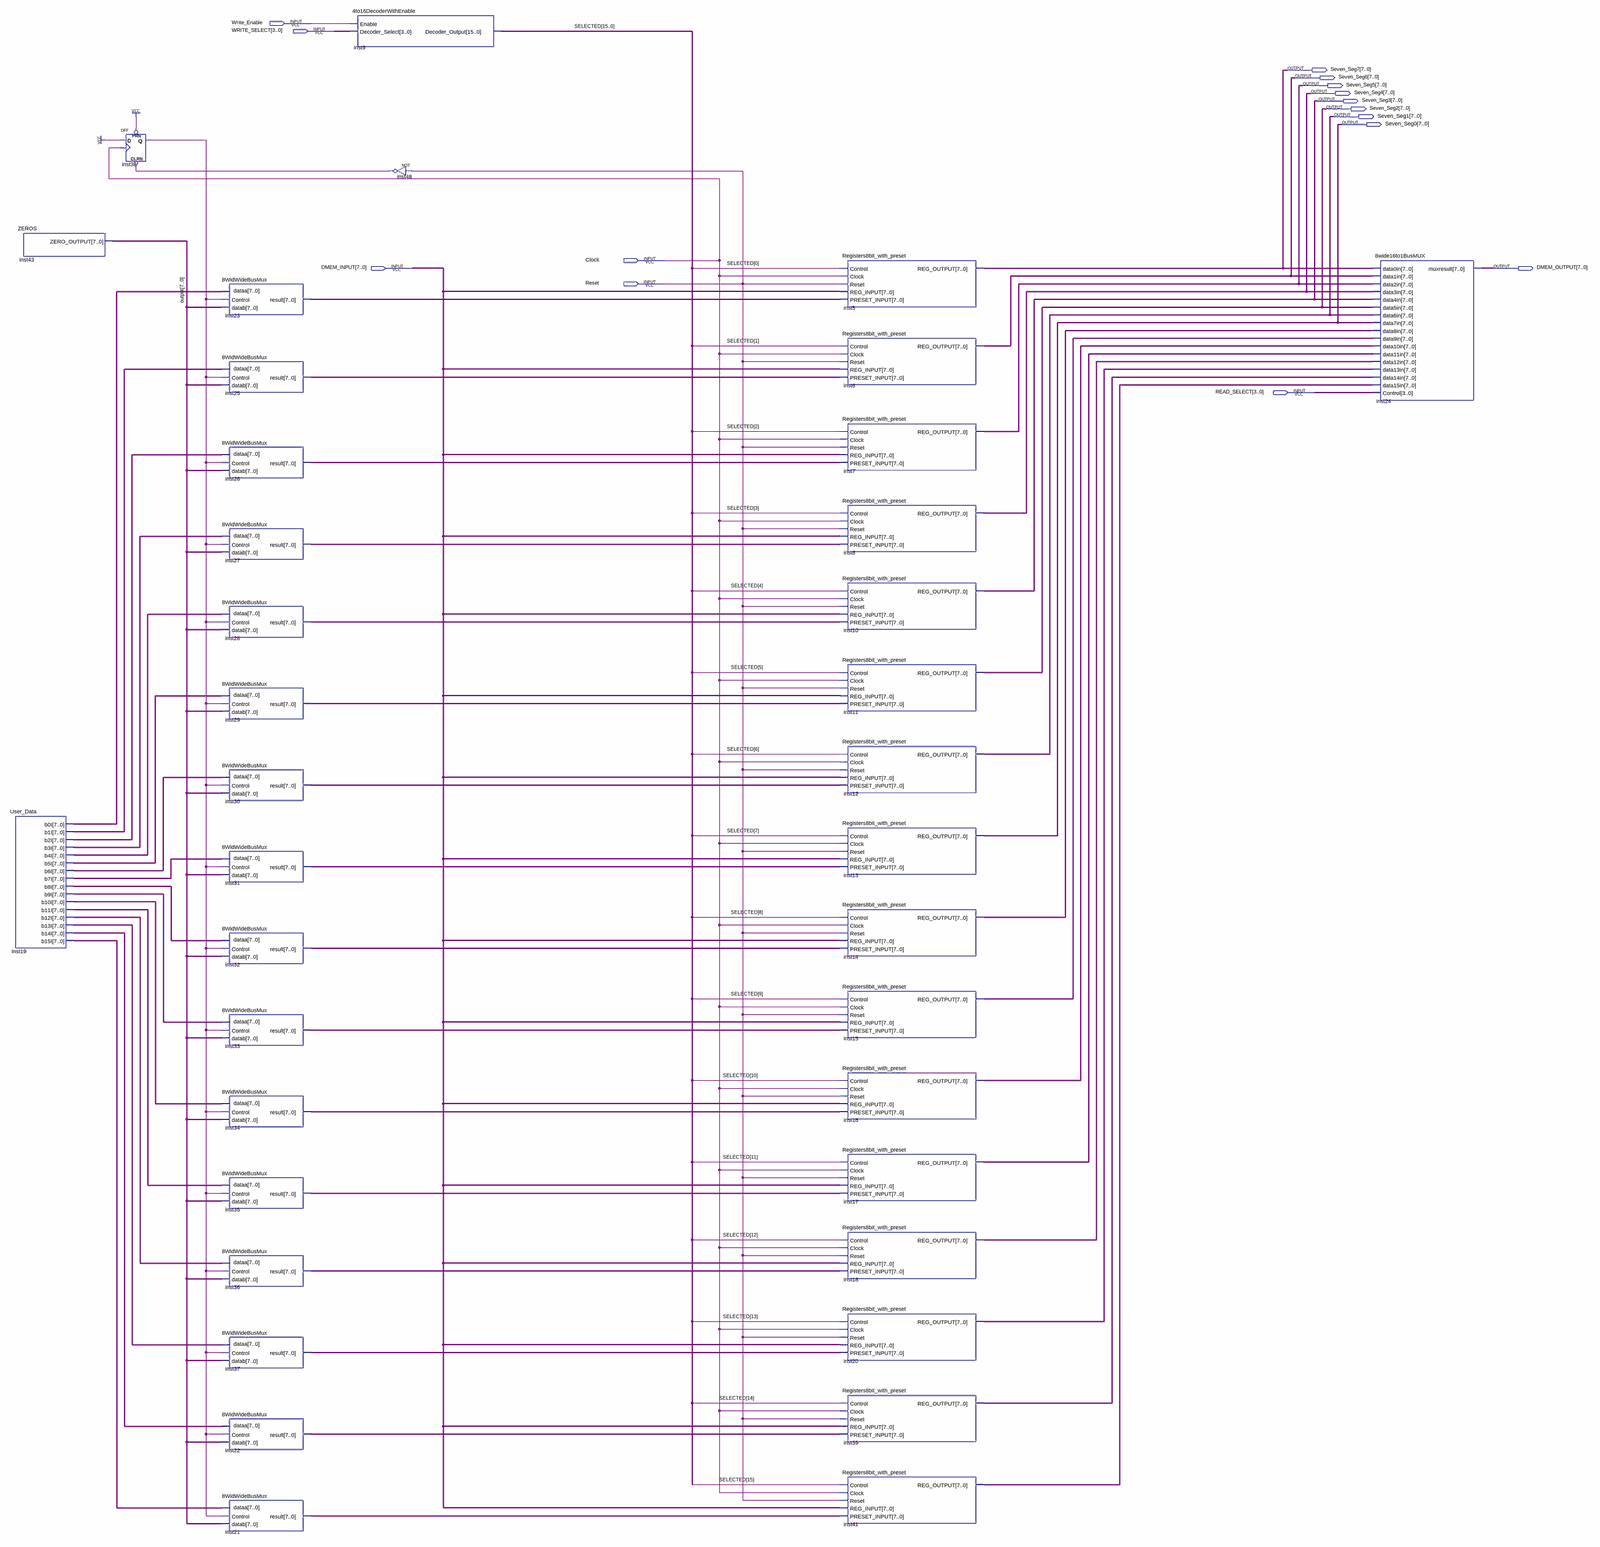
[diagram p0: schematic sheet, whole]
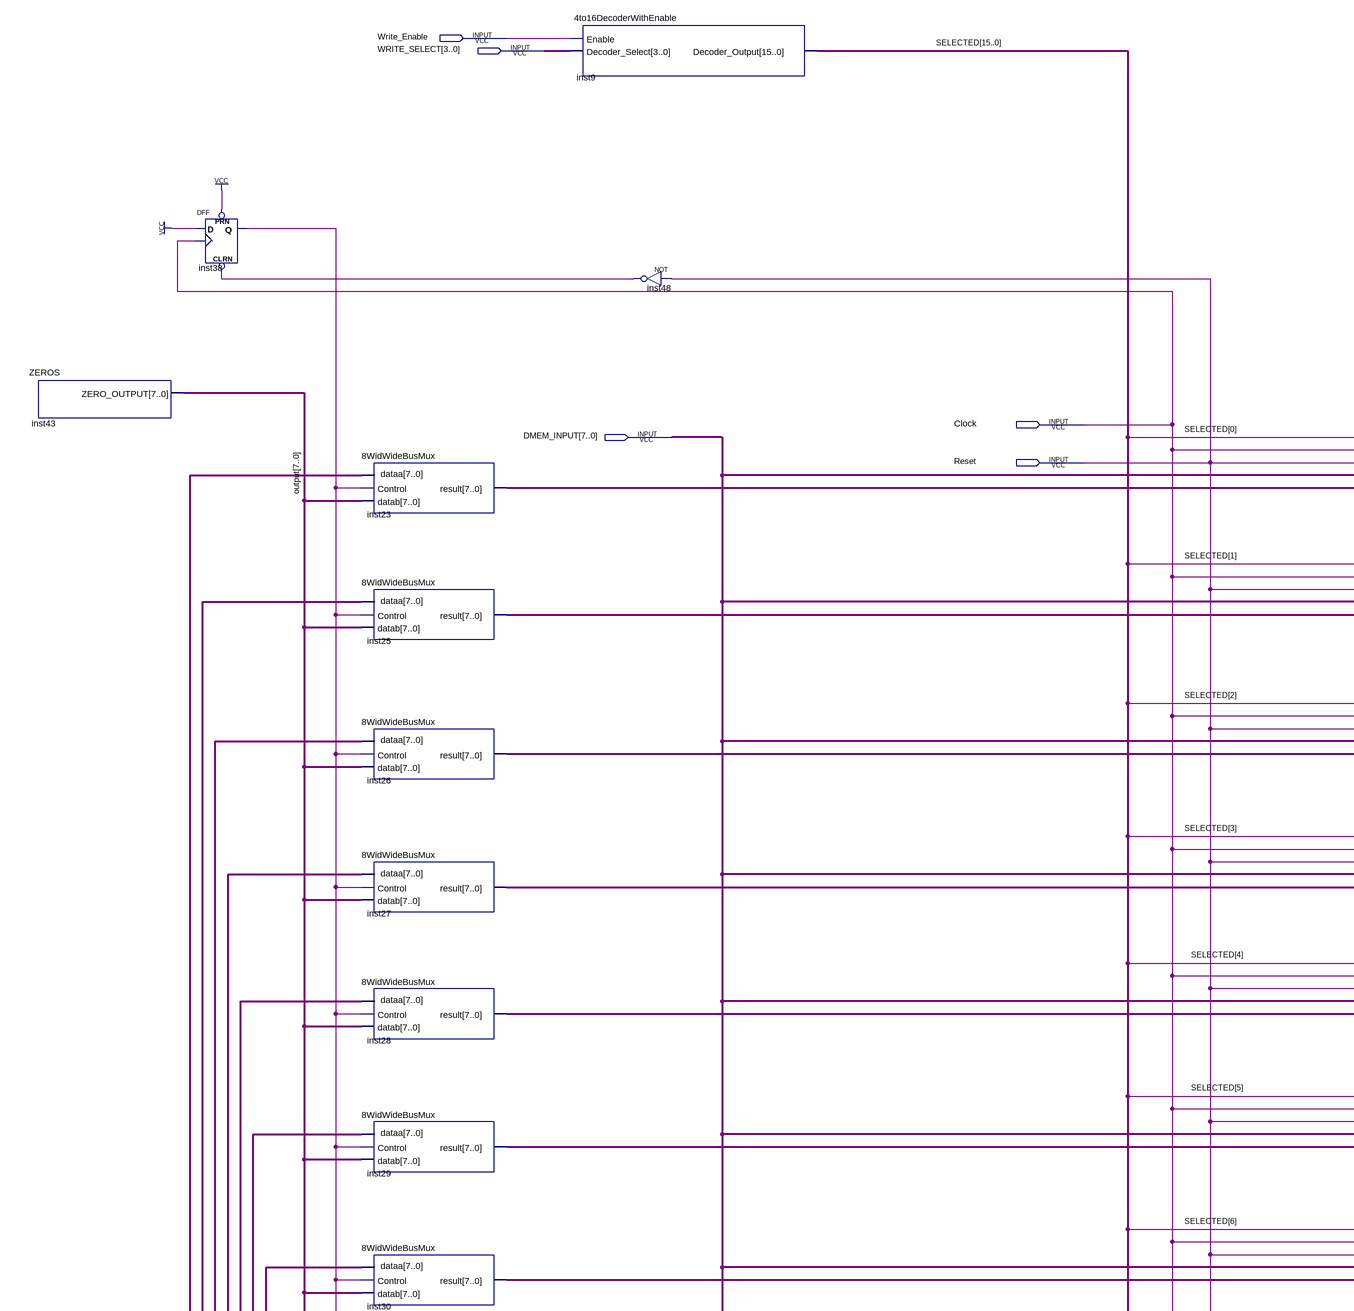
[diagram p1: schematic sheet, upper left part]
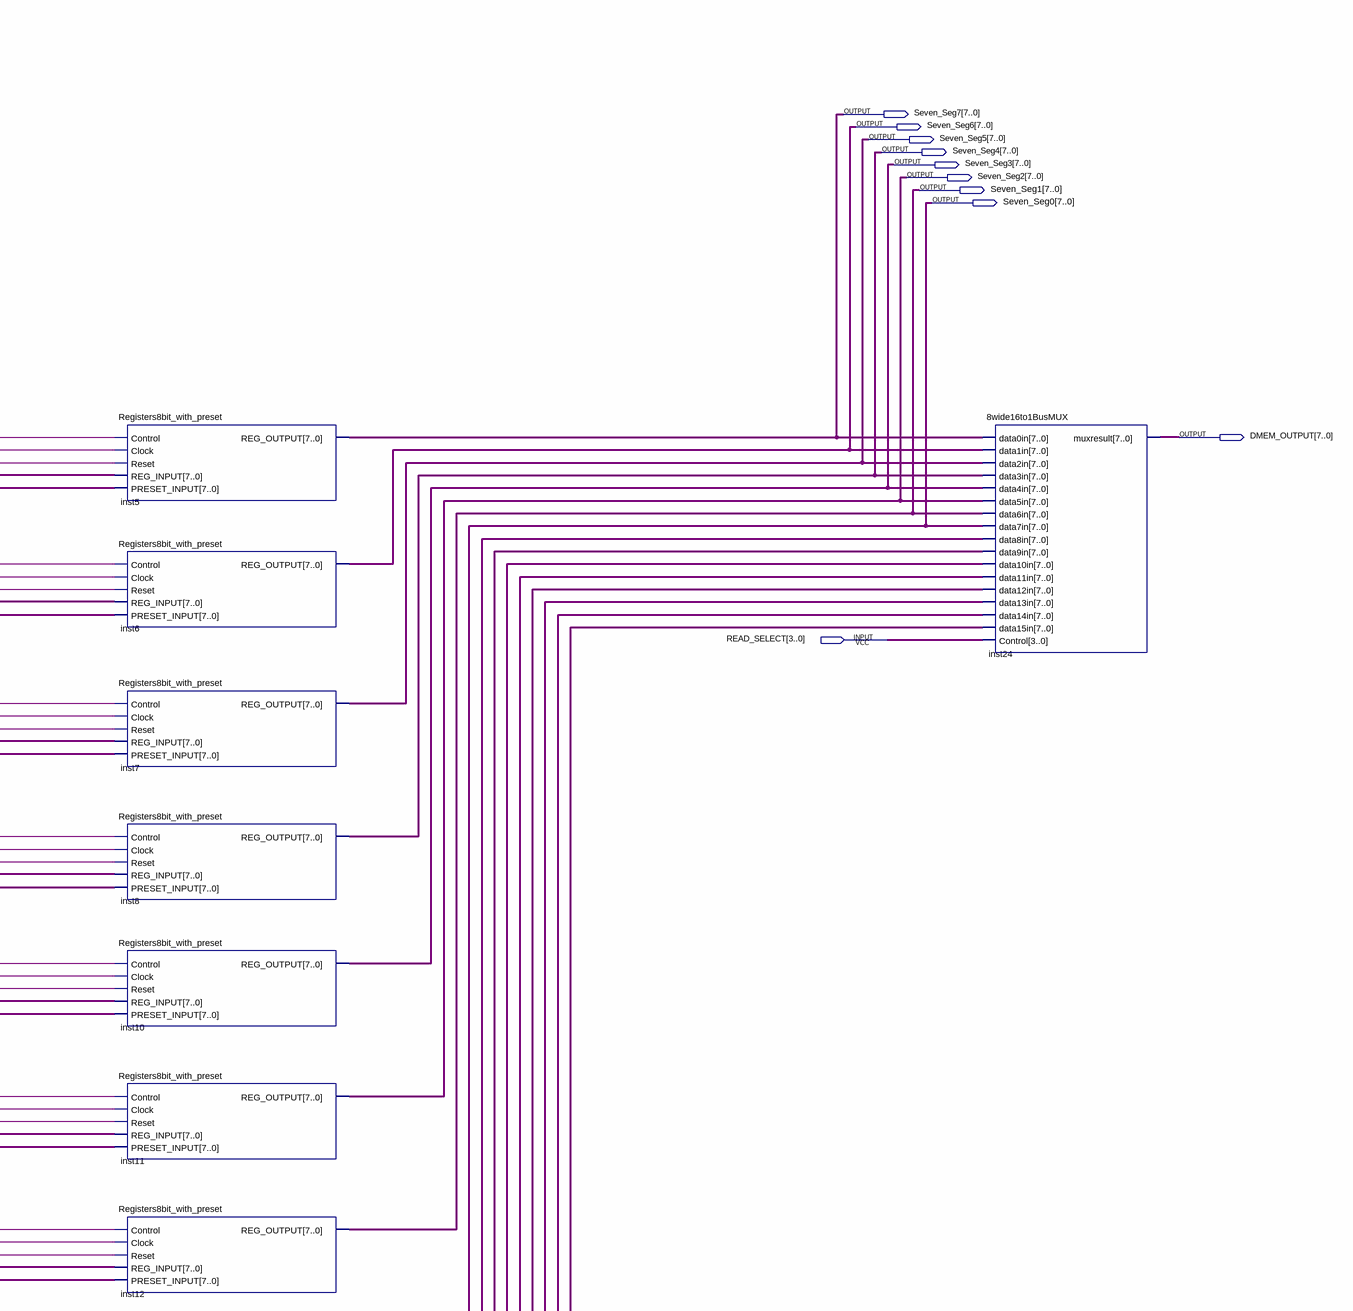
[diagram p2: schematic sheet, upper right part]
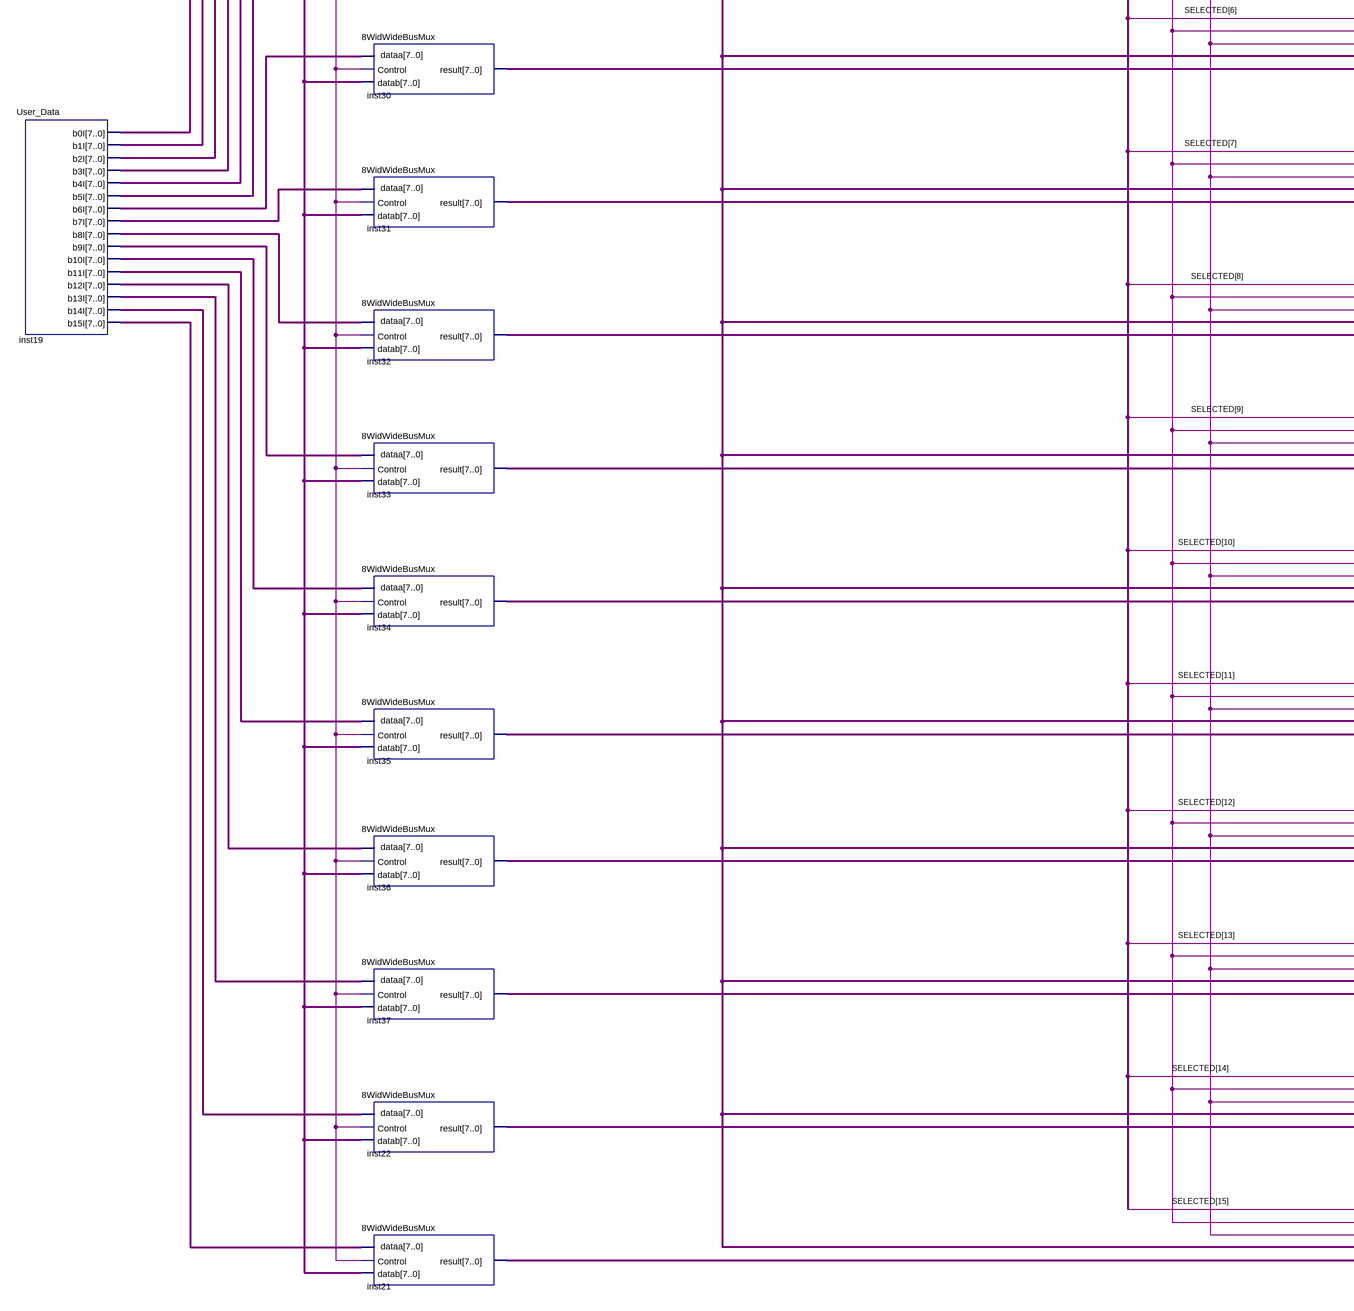
[diagram p3: schematic sheet, lower left part]
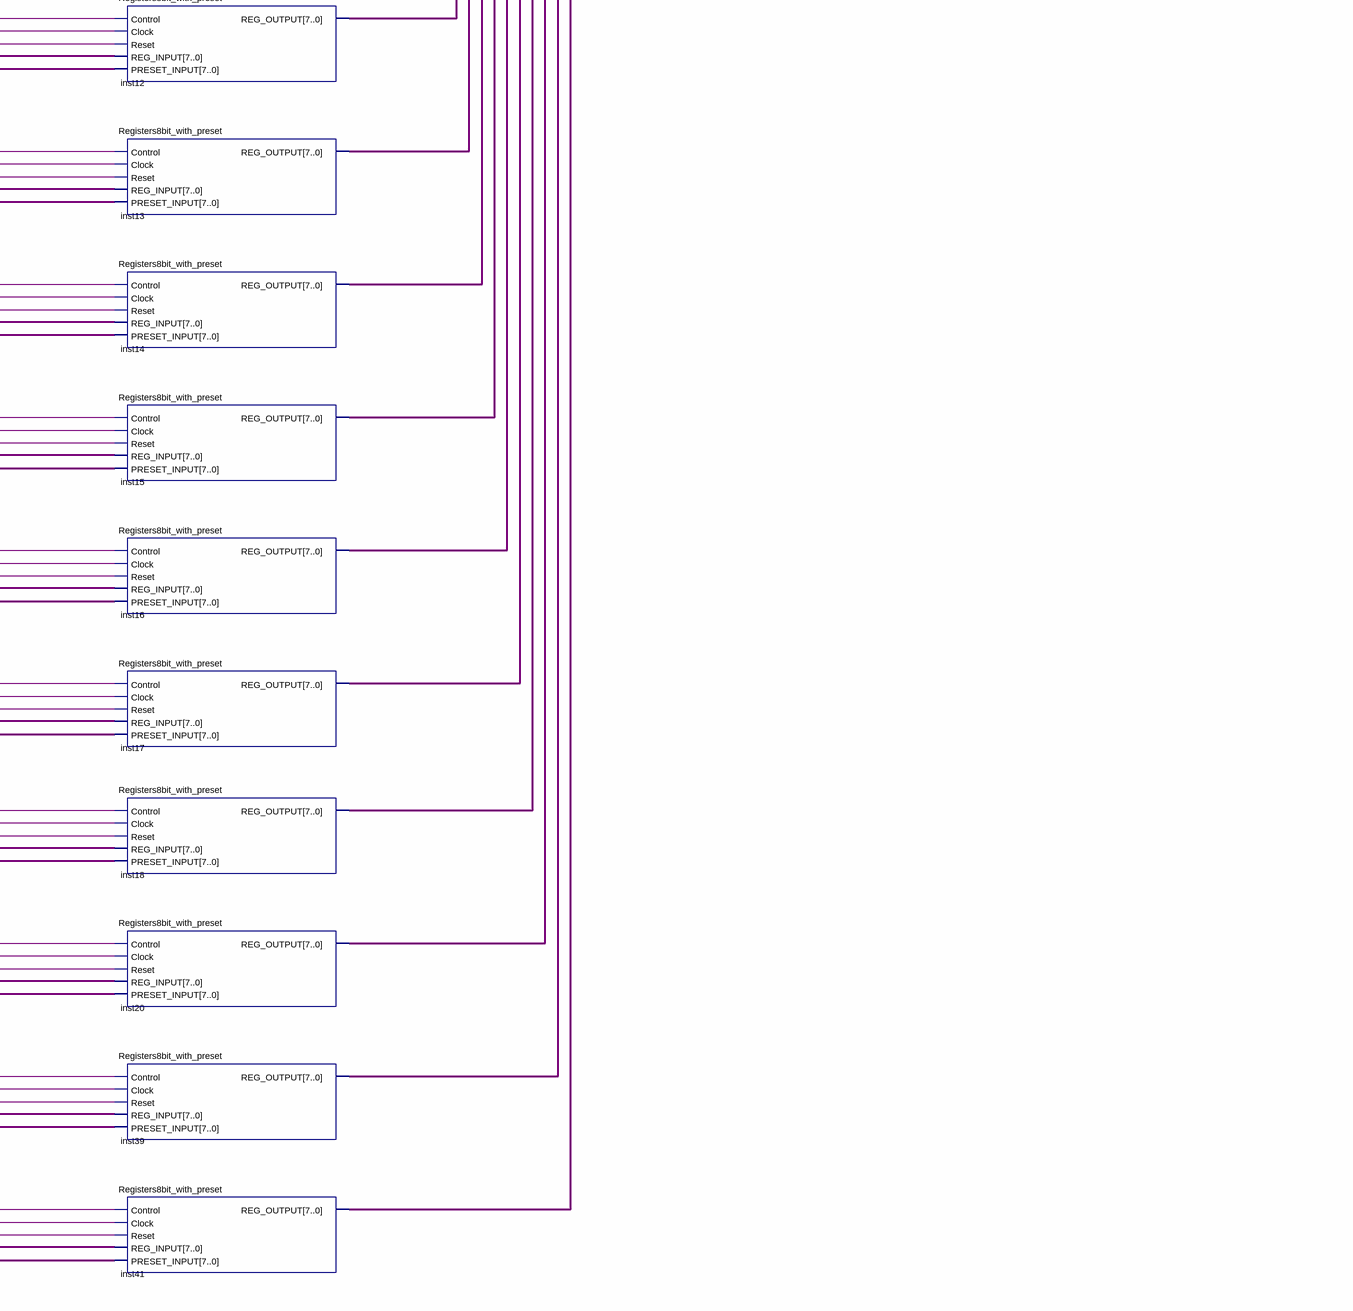
[diagram p4: schematic sheet, lower right part]
// Quartus schematic DMEM_with_preset.bdf as structural Verilog: 38 symbols, 15 pins
module DMEM_with_preset (
  input  Write_Enable,
  input  [3:0] WRITE_SELECT,
  input  Clock,
  input  [7:0] DMEM_INPUT,
  input  Reset,
  input  [3:0] READ_SELECT,
  output [7:0] Seven_Seg7,
  output [7:0] Seven_Seg6,
  output [7:0] Seven_Seg5,
  output [7:0] Seven_Seg4,
  output [7:0] Seven_Seg3,
  output [7:0] Seven_Seg2,
  output [7:0] Seven_Seg1,
  output [7:0] Seven_Seg0,
  output [7:0] DMEM_OUTPUT
);

  wire inst38_q, inst48_out;
  wire [7:0] inst14_reg_output, inst15_reg_output, inst16_reg_output, inst17_reg_output, inst18_reg_output,
       inst19_b0i, inst19_b1i, inst19_b2i, inst19_b3i, inst19_b4i, inst19_b5i, inst19_b6i, inst19_b7i,
       inst19_b8i, inst19_b9i, inst19_b10i, inst19_b11i, inst19_b12i, inst19_b13i, inst19_b14i, inst19_b15i,
       inst20_reg_output, inst21_result, inst22_result, inst23_result, inst25_result, inst26_result,
       inst27_result, inst28_result, inst29_result, inst30_result, inst31_result, inst32_result,
       inst33_result, inst34_result, inst35_result, inst36_result, inst37_result, inst39_reg_output,
       inst41_reg_output, \output ;
  wire [15:0] SELECTED;

  ZEROS inst43 (.ZERO_OUTPUT(\output ));
  User_Data inst19 (
    .b0I(inst19_b0i), .b1I(inst19_b1i), .b2I(inst19_b2i), .b3I(inst19_b3i), .b4I(inst19_b4i),
    .b5I(inst19_b5i), .b6I(inst19_b6i), .b7I(inst19_b7i), .b8I(inst19_b8i), .b9I(inst19_b9i),
    .b10I(inst19_b10i), .b11I(inst19_b11i), .b12I(inst19_b12i), .b13I(inst19_b13i), .b14I(inst19_b14i),
    .b15I(inst19_b15i));
  DFF inst38 (.CLRN(inst48_out), .CLK(Clock), .D(1'b1), .PRN(1'b1), .Q(inst38_q));
  \8WidWideBusMux  inst23 (.Control(inst38_q), .dataa(inst19_b0i), .datab(\output ), .result(inst23_result));
  \8WidWideBusMux  inst25 (.Control(inst38_q), .dataa(inst19_b1i), .datab(\output ), .result(inst25_result));
  \8WidWideBusMux  inst26 (.Control(inst38_q), .dataa(inst19_b2i), .datab(\output ), .result(inst26_result));
  \8WidWideBusMux  inst27 (.Control(inst38_q), .dataa(inst19_b3i), .datab(\output ), .result(inst27_result));
  \8WidWideBusMux  inst28 (.Control(inst38_q), .dataa(inst19_b4i), .datab(\output ), .result(inst28_result));
  \8WidWideBusMux  inst29 (.Control(inst38_q), .dataa(inst19_b5i), .datab(\output ), .result(inst29_result));
  \8WidWideBusMux  inst30 (.Control(inst38_q), .dataa(inst19_b6i), .datab(\output ), .result(inst30_result));
  \8WidWideBusMux  inst31 (.Control(inst38_q), .dataa(inst19_b7i), .datab(\output ), .result(inst31_result));
  \8WidWideBusMux  inst32 (.Control(inst38_q), .dataa(inst19_b8i), .datab(\output ), .result(inst32_result));
  \8WidWideBusMux  inst33 (.Control(inst38_q), .dataa(inst19_b9i), .datab(\output ), .result(inst33_result));
  \8WidWideBusMux  inst34 (.Control(inst38_q), .dataa(inst19_b10i), .datab(\output ), .result(inst34_result));
  \8WidWideBusMux  inst35 (.Control(inst38_q), .dataa(inst19_b11i), .datab(\output ), .result(inst35_result));
  \8WidWideBusMux  inst36 (.Control(inst38_q), .dataa(inst19_b12i), .datab(\output ), .result(inst36_result));
  \8WidWideBusMux  inst37 (.Control(inst38_q), .dataa(inst19_b13i), .datab(\output ), .result(inst37_result));
  \8WidWideBusMux  inst22 (.Control(inst38_q), .dataa(inst19_b14i), .datab(\output ), .result(inst22_result));
  \8WidWideBusMux  inst21 (.Control(inst38_q), .dataa(inst19_b15i), .datab(\output ), .result(inst21_result));
  \4to16DecoderWithEnable  inst9 (.Enable(Write_Enable), .Decoder_Select(WRITE_SELECT), .Decoder_Output(SELECTED));
  not inst48 (inst48_out, Reset);
  Registers8bit_with_preset inst5 (
    .Control(SELECTED[0]), .PRESET_INPUT(inst23_result), .Clock(Clock), .Reset(Reset),
    .REG_INPUT(DMEM_INPUT), .REG_OUTPUT(Seven_Seg7));
  Registers8bit_with_preset inst6 (
    .Control(SELECTED[1]), .PRESET_INPUT(inst25_result), .Clock(Clock), .Reset(Reset),
    .REG_INPUT(DMEM_INPUT), .REG_OUTPUT(Seven_Seg6));
  Registers8bit_with_preset inst7 (
    .Control(SELECTED[2]), .PRESET_INPUT(inst26_result), .Clock(Clock), .Reset(Reset),
    .REG_INPUT(DMEM_INPUT), .REG_OUTPUT(Seven_Seg5));
  Registers8bit_with_preset inst8 (
    .Control(SELECTED[3]), .PRESET_INPUT(inst27_result), .Clock(Clock), .Reset(Reset),
    .REG_INPUT(DMEM_INPUT), .REG_OUTPUT(Seven_Seg4));
  Registers8bit_with_preset inst10 (
    .Control(SELECTED[4]), .PRESET_INPUT(inst28_result), .Clock(Clock), .Reset(Reset),
    .REG_INPUT(DMEM_INPUT), .REG_OUTPUT(Seven_Seg3));
  Registers8bit_with_preset inst11 (
    .Control(SELECTED[5]), .PRESET_INPUT(inst29_result), .Clock(Clock), .Reset(Reset),
    .REG_INPUT(DMEM_INPUT), .REG_OUTPUT(Seven_Seg2));
  Registers8bit_with_preset inst12 (
    .Control(SELECTED[6]), .PRESET_INPUT(inst30_result), .Clock(Clock), .Reset(Reset),
    .REG_INPUT(DMEM_INPUT), .REG_OUTPUT(Seven_Seg1));
  Registers8bit_with_preset inst13 (
    .Control(SELECTED[7]), .PRESET_INPUT(inst31_result), .Clock(Clock), .Reset(Reset),
    .REG_INPUT(DMEM_INPUT), .REG_OUTPUT(Seven_Seg0));
  Registers8bit_with_preset inst14 (
    .Control(SELECTED[8]), .PRESET_INPUT(inst32_result), .Clock(Clock), .Reset(Reset),
    .REG_INPUT(DMEM_INPUT), .REG_OUTPUT(inst14_reg_output));
  Registers8bit_with_preset inst15 (
    .Control(SELECTED[9]), .PRESET_INPUT(inst33_result), .Clock(Clock), .Reset(Reset),
    .REG_INPUT(DMEM_INPUT), .REG_OUTPUT(inst15_reg_output));
  Registers8bit_with_preset inst16 (
    .Control(SELECTED[10]), .PRESET_INPUT(inst34_result), .Clock(Clock), .Reset(Reset),
    .REG_INPUT(DMEM_INPUT), .REG_OUTPUT(inst16_reg_output));
  Registers8bit_with_preset inst17 (
    .Control(SELECTED[11]), .PRESET_INPUT(inst35_result), .Clock(Clock), .Reset(Reset),
    .REG_INPUT(DMEM_INPUT), .REG_OUTPUT(inst17_reg_output));
  Registers8bit_with_preset inst18 (
    .Control(SELECTED[12]), .PRESET_INPUT(inst36_result), .Clock(Clock), .Reset(Reset),
    .REG_INPUT(DMEM_INPUT), .REG_OUTPUT(inst18_reg_output));
  Registers8bit_with_preset inst20 (
    .Control(SELECTED[13]), .PRESET_INPUT(inst37_result), .Clock(Clock), .Reset(Reset),
    .REG_INPUT(DMEM_INPUT), .REG_OUTPUT(inst20_reg_output));
  Registers8bit_with_preset inst39 (
    .Control(SELECTED[14]), .PRESET_INPUT(inst22_result), .Clock(Clock), .Reset(Reset),
    .REG_INPUT(DMEM_INPUT), .REG_OUTPUT(inst39_reg_output));
  Registers8bit_with_preset inst41 (
    .Control(SELECTED[15]), .PRESET_INPUT(inst21_result), .Clock(Clock), .Reset(Reset),
    .REG_INPUT(DMEM_INPUT), .REG_OUTPUT(inst41_reg_output));
  \8wide16to1BusMUX  inst24 (
    .data0in(Seven_Seg7), .data1in(Seven_Seg6), .data2in(Seven_Seg5), .data3in(Seven_Seg4),
    .data4in(Seven_Seg3), .data5in(Seven_Seg2), .data6in(Seven_Seg1), .data7in(Seven_Seg0),
    .data8in(inst14_reg_output), .data9in(inst15_reg_output), .data10in(inst16_reg_output),
    .data11in(inst17_reg_output), .data12in(inst18_reg_output), .data13in(inst20_reg_output),
    .data14in(inst39_reg_output), .data15in(inst41_reg_output), .Control(READ_SELECT), .muxresult(DMEM_OUTPUT));
endmodule
